# Altium schematic sheet PowerManagementSlave.SchDoc: LTC3550 Power Management - Slave
size A4; Author: Hardik Senjaliya; DrawnBy: Hardik Senjaliya; Engineer: Hardik Senjaliya; Organization: University of Colorado; Address1: Boulder; Address2: Bhishma; Address3: Low Power Embedded; Address4: Design Techniques; Revision: 0.1; SheetNumber: 7; SheetTotal: 9; ProjectName: Bhishma
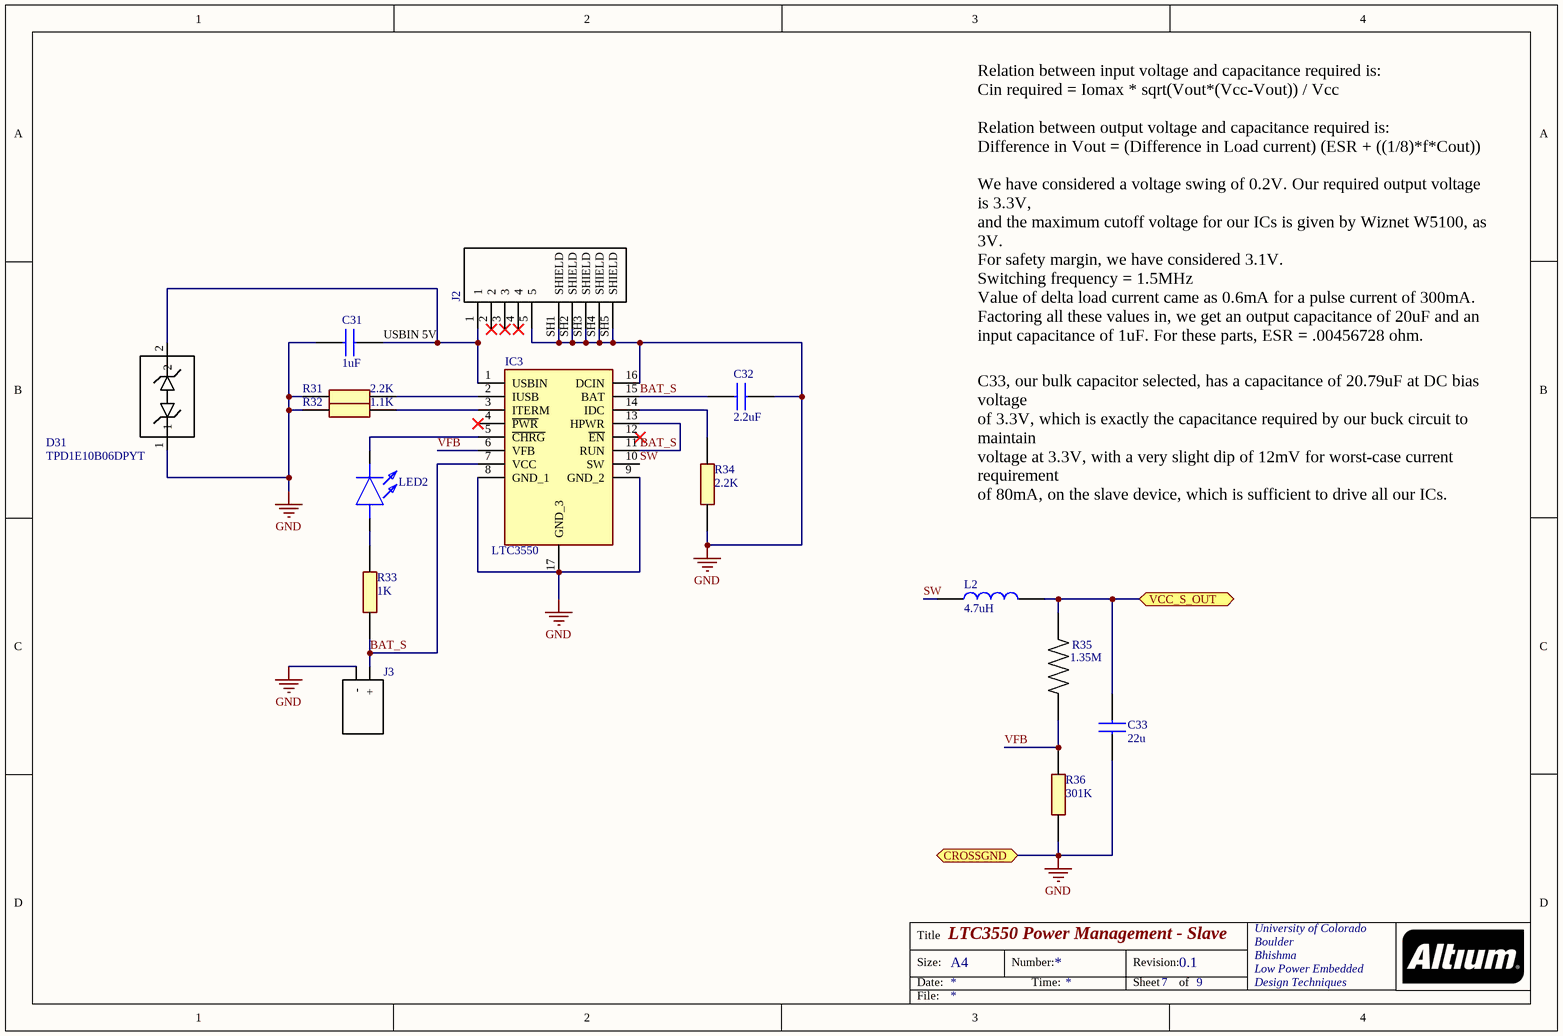
[diagram p0: PowerManagementSlave.SchDoc]

## Parts
C31  value 1uF  [CAPC1608X90N]  (hidden comment: 81-GCM188R71C105K64D)
C32  value 2.2uF  [CAPC1608X90N]  (hidden comment: 81-GRM188C71E225KE1J)
C33  value 22u  [CAPC1608X90N]  (hidden comment: 581-06036D226MAT2A)
D31  value TPD1E10B06DPYT  [*DFN100X60X45-2N]  (hidden comment: 595-TPD1E10B06DPYT)
IC3  value LTC3550  [SON50P300X500X85-17N-D]  (hidden comment: 584-LTC3550EDHC#PBF)
J2  490-UJ2-MIBH2-4-SMT  [*CUI_UJ2-MIBH2-4-SMT-TR_UJ2-MIBH2-4-SMT-TR(Primary)]  (value not drawn)
J3  710-691508110302  [691508110302]  (value not drawn)
L2  value 4.7uH  [INDPM6060X300N]  (hidden comment: 810-SLF6028T-4R7M)
LED2  630-HSMC-C190  [LEDC1608X90N]  (value not drawn)
R31  value 2.2K  [RESC1608X55N]  (hidden comment: 594-MCT06030D2201BP1)
R32  value 1.1K  [RESC1608X55N]  (hidden comment: 667-ERA-3ARB112V)
R33  value 1K  [RESC1608X55N]  (hidden comment: 594-MCT0603MD1001BP5)
R34  value 2.2K  [RESC1608X55N]  (hidden comment: 594-MCT06030D2201BP1)
R35  value 1.35M  [*RESC3216X65N]  (hidden comment: 71-TNPW12061M35BEEN)
R36  value 301K  [RESC1608X55N]  (hidden comment: 667-ERA-3AEB3013V)

## Ports
CROSSGND, VCC_S_OUT

## Nets
GND: C31.1 C32.2 C33.1 D31.1 IC3.8(GND_1) IC3.9(GND_2) IC3.16(DCIN) IC3.17(GND_3) J2.5 J2.SH1(SHIELD) J2.SH2(SHIELD) J2.SH3(SHIELD) J2.SH4(SHIELD) J2.SH5(SHIELD) J3.1(-) R31.1 R32.1 R34.2 R36.1 ; port CROSSGND
BAT_S: C32.1 IC3.7(VCC) IC3.11(RUN) IC3.13(HPWR) IC3.15(BAT) J3.2(+) R33.1
SW: IC3.10(SW) L2.1
VCC_S_OUT: C33.2 L2.2 R35.2 ; port VCC_S_OUT
VFB: IC3.6(VFB) R35.1 R36.2
NetC31_2: C31.2 D31.2 IC3.1(USBIN) J2.1
NetIC3_2: IC3.2(IUSB) R31.2
NetIC3_3: IC3.3(ITERM) R32.2
NetIC3_5: IC3.5(~{CHRG}) LED2.1(K)
NetIC3_14: IC3.14(IDC) R34.1
NetLED2_2: LED2.2(A) R33.2

Not connected (* = marked no-connect by the designer): IC3 4(~{PWR})* 12(~{EN})*; J2 2* 3* 4*

## Notes on the sheet
- (near C31) USBIN 5V
- Relation between input voltage and capacitance required is:
  Cin required = Iomax * sqrt(Vout*(Vcc-Vout)) / Vcc
  Relation between output voltage and capacitance required is:
  Difference in Vout = (Difference in Load current) (ESR + ((1/8)*f*Cout))
  We have considered a voltage swing of 0.2V. Our required output voltage is 3.3V,
  and the maximum cutoff voltage for our ICs is given by Wiznet W5100, as 3V.
  For safety margin, we have considered 3.1V.
  Switching frequency = 1.5MHz
  Value of delta load current came as 0.6mA for a pulse current of 300mA.
  Factoring all these values in, we get an output capacitance of 20uF and an
  input capacitance of 1uF. For these parts, ESR = .00456728 ohm.
- C33, our bulk capacitor selected, has a capacitance of 20.79uF at DC bias voltage
  of 3.3V, which is exactly the capacitance required by our buck circuit to maintain
  voltage at 3.3V, with a very slight dip of 12mV for worst-case current requirement
  of 80mA, on the slave device, which is sufficient to drive all our ICs.
- Title
- Size:
- Date:
- A4
- Number:
- Time:
- Revision:
- Sheet
- of
- File:

## Library data of the parts
C31 = GCM188R71C105KA64D: Capacitor; Manufacturer_Name: Murata Electronics; Datasheet Link: https://psearch.en.murata.com/capacitor/product/GCM188R71C105KA64%23.html; Height: 0.9mm; Manufacturer_Part_Number: GCM188R71C105KA64D; Mouser Part Number: 81-GCM188R71C105K64D; Mouser Price/Stock: https://www.mouser.com/Search/Refine.aspx?Keyword=81-GCM188R71C105K64D; RS Part Number: 7900562P; RS Price/Stock: http://uk.rs-online.com/web/p/products/7900562P
C32 = GRM188C71E225KE11J: Capacitor; Manufacturer_Name: Murata Electronics; Datasheet Link: https://psearch.en.murata.com/capacitor/product/GRM188C71E225KE11%23.html; Height: 0.9mm; Manufacturer_Part_Number: GRM188C71E225KE11J; Mouser Part Number: 81-GRM188C71E225KE1J; Mouser Price/Stock: https://www.mouser.com/Search/Refine.aspx?Keyword=81-GRM188C71E225KE1J
C33 = 06036D226MAT2A: Capacitor; Manufacturer_Name: AVX; Datasheet Link: https://componentsearchengine.com/Datasheets/1/06031A100FAT2A.pdf; Height: 0.9mm; Manufacturer_Part_Number: 06036D226MAT2A; Mouser Part Number: 581-06036D226MAT2A; Mouser Price/Stock: https://www.mouser.com/Search/Refine.aspx?Keyword=581-06036D226MAT2A
D31 = TPD1E10B06DPYT: Single-Channel ESD in 0402 Package With 10pF Capacitance and 6V Breakdown 2-X1SON -40 to 125; Manufacturer_Name: Texas Instruments; Package: XDFN-2 Texas Instruments; Manufacturer_Part_Number: TPD1E10B06DPYT; Availability: Unavailable; SnapEDA_Link: https://www.snapeda.com/parts/TPD1E10B06DPYT/Texas%20Instruments/view-part/?ref=snap; Price: None; Mouser_Part_Number: 595-TPD1E10B06DPYT; Datasheet Link: www.ti.com/lit/ds/symlink/tpd1e10b06.pdf
IC3 = LTC3550EDHC#PBF: Integrated Circuit; Manufacturer_Name: Linear Technology; Datasheet Link: https://www.analog.com/media/en/technical-documentation/data-sheets/3550fa.pdf; Height: 0.85mm; Manufacturer_Part_Number: LTC3550EDHC#PBF; Mouser Part Number: 584-LTC3550EDHC#PBF; Mouser Price/Stock: https://www.mouser.com/Search/Refine.aspx?Keyword=584-LTC3550EDHC%23PBF
J2 = UJ2-MIBH2-4-SMT-TR: Micro B, USB 2.0, 1.8 A, Right Angle, Surface Mount _SMT_, USB Receptacle; Manufacturer_Name: CUI Devices; Mouser Part Number: 490-UJ2-MIBH2-4-SMT; Package: None; SnapEDA_Link: https://www.snapeda.com/parts/UJ2-MIBH2-4-SMT-TR/CUI%20Devices/view-part/?ref=snap; CUI_purchase_URL: https://www.cuidevices.com/product/interconnect/connectors/usb-connectors/uj2-mibh2-4-smt?utm_source=snapeda.com&utm_medium=referral&utm_campaign=snapedaBOM; Manufacturer_Part_Number: UJ2-MIBH2-4-SMT-TR; Value: UJ2-MIBH2-4-SMT-TR; Datasheet Link: https://www.mouser.com/datasheet/2/670/uj2-mibh2-4-smt-1313423.pdf
J3 = 691508110302: 5081 Series 3.5mm Pitch Horizontal, PCBTerminal Block, Surface Mount, 2 Way; Manufacturer_Name: Wurth Electronics; Manufacturer_Part_Number: 691508110302; Datasheet Link: https://www.mouser.com/datasheet/2/445/6915081103xx-469297.pdf; Mouser Part Number: 710-691508110302; Value: *
L2 = SLF6028T-4R7M1R6-PF: Inductor; Manufacturer_Name: TDK; Datasheet Link: https://product.tdk.com/info/en/document/catalog/smd/inductor_commercial_power_slf6028_en.pdf; Height: 3mm; Manufacturer_Part_Number: SLF6028T-4R7M1R6-PF; Mouser Part Number: 810-SLF6028T-4R7M; Mouser Price/Stock: https://www.mouser.com/Search/Refine.aspx?Keyword=810-SLF6028T-4R7M; RS Part Number: 7413399P; RS Price/Stock: http://uk.rs-online.com/web/p/products/7413399P
LED2 = HSMC-C190: LED; Manufacturer_Name: Avago Technologies; Datasheet Link: http://www.mouser.hk/ProductDetail/Broadcom-Avago/HSMC-C190/?qs=YDL0qNrpDT4TTmzDJNXHWQ==; Height: 0.9mm; Manufacturer_Part_Number: HSMC-C190; Mouser Part Number: 630-HSMC-C190; Mouser Price/Stock: https://www.mouser.com/Search/Refine.aspx?Keyword=630-HSMC-C190; RS Part Number: 6910391P; RS Price/Stock: http://uk.rs-online.com/web/p/products/6910391P
R31 R34 = MCT06030D2201BP100: Resistor; Manufacturer_Name: Vishay; Allied_Number: 70398207; Datasheet Link: http://www.vishay.com/docs/28705/mcx0x0xpro.pdf; Height: 0.55mm; Manufacturer_Part_Number: MCT06030D2201BP100; Mouser Part Number: 594-MCT06030D2201BP1; Mouser Price/Stock: https://www.mouser.com/Search/Refine.aspx?Keyword=594-MCT06030D2201BP1; RS Part Number: 6845474; RS Price/Stock: https://uk.rs-online.com/web/p/products/6845474; Allied Price/Stock: https://www.alliedelec.com/vishay-dale-mct06030d2201bp100/70398207/
R32 = ERA-3ARB112V: Resistor; Manufacturer_Name: Panasonic; Datasheet Link: https://industrial.panasonic.com/cdbs/www-data/pdf/RDM0000/AOA0000C307.pdf; Height: 0.55mm; Manufacturer_Part_Number: ERA-3ARB112V; Mouser Part Number: 667-ERA-3ARB112V; Mouser Price/Stock: https://www.mouser.com/Search/Refine.aspx?Keyword=667-ERA-3ARB112V
R33 = MCT0603MD1001BP500: Resistor; Manufacturer_Name: Vishay; Datasheet Link: http://www.vishay.com/docs/28705/mcx0x0xpro.pdf; Height: 0.55mm; Manufacturer_Part_Number: MCT0603MD1001BP500; Mouser Part Number: 594-MCT0603MD1001BP5; Mouser Price/Stock: https://www.mouser.com/Search/Refine.aspx?Keyword=594-MCT0603MD1001BP5
R35 = TNPW12061M35BETA: Res Thin Film 1206 1.35M Ohm 0.1% 0.25W_1/4W_ Â±25ppm/C Molded SMD Paper T/R; Manufacturer_Name: Vishay; Package: 3216 Rohm Semiconductor; Manufacturer_Part_Number: TNPW12061M35BEEN; Availability: Unavailable; SnapEDA_Link: https://www.snapeda.com/parts/TNPW12061M35BETA/Vishay/view-part/?ref=snap; Price: None; Mouser Part Number: 71-TNPW12061M35BEEN; Datasheet Link: https://www.mouser.com/datasheet/2/427/tnpw_e3-470510.pdf
R36 = ERA-3AEB3013V: Resistor; Manufacturer_Name: Panasonic; Datasheet Link: https://industrial.panasonic.com/cdbs/www-data/pdf/RDM0000/AOA0000C307.pdf; Height: 0.55mm; Manufacturer_Part_Number: ERA-3AEB3013V; Mouser Part Number: 667-ERA-3AEB3013V; Mouser Price/Stock: https://www.mouser.com/Search/Refine.aspx?Keyword=667-ERA-3AEB3013V